# EasyEDA Pro project ProProject_Access Control Interface_2024-06-07.epro

# Schematic V2.0.1 Schematic
Create Date: 2024-06-04; Page Name: Main Page.V2.0.1 Schematic; Project Name: Access Control Interface; Schematic Name: V2.0.1 Schematic; Update Date: 2024-06-07; Company: RIT SHED MAKERSPACE; Drawn: Jim Heaney; Page Size: A4; Part Number: JLCPCB-002; Reviewed: Jim Heaney; Version: V0.1
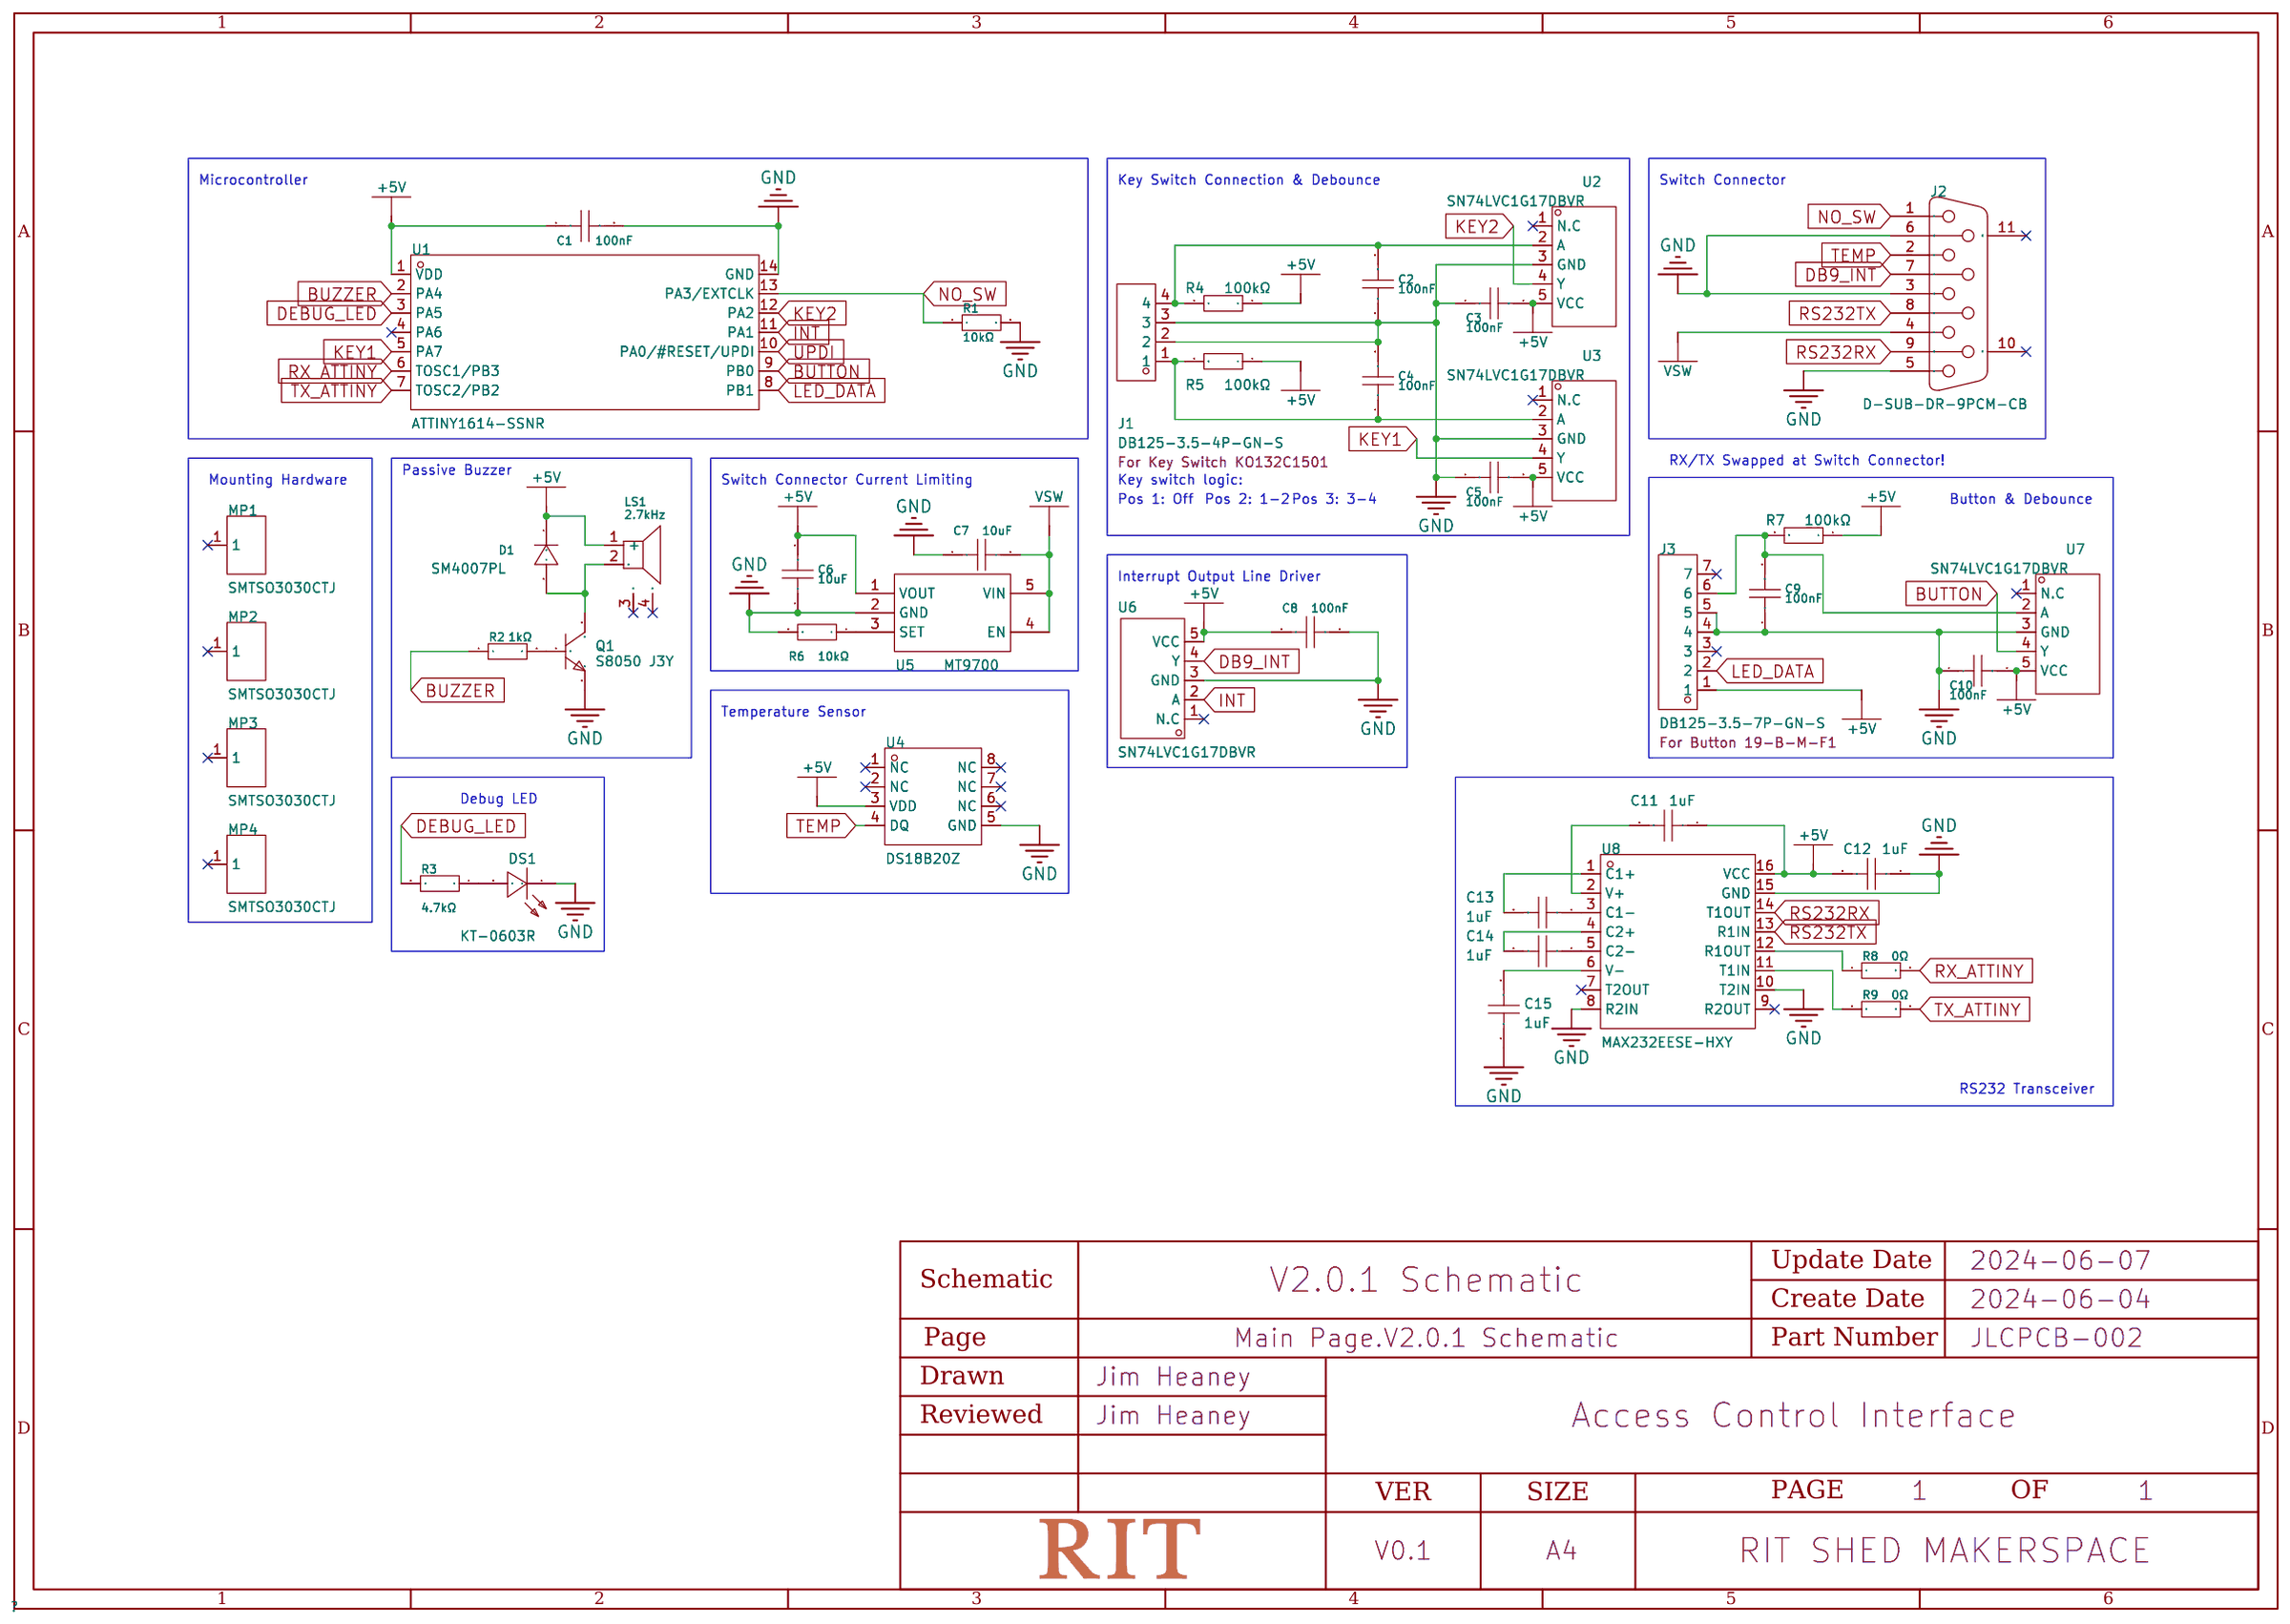
[diagram p0: schematic sheet]

## Parts
C1  100nF  [C0603]
C2  100nF  [C0603]
C3  100nF  [C0603]
C4  100nF  [C0603]
C5  100nF  [C0603]
C6  10uF  [C0603]
C7  10uF  [C0603]
C8  100nF  [C0603]
C9  100nF  [C0603]
C10  100nF  [C0603]
C11  1uF  [C0603]
C12  1uF  [C0603]
C13  1uF  [C0603]
C14  1uF  [C0603]
C15  1uF  [C0603]
D1  SM4007PL  [SOD-123F_L2.8-W1.8-LS3.7-RD]
DS1  KT-0603R  [LED0603-RD]
J1  DB125-3.5-4P-GN-S  [CONN-TH_DB125-3.5-4P-GN]
J2  D-SUB-DR-9PCM-CB  [DB9-TH_ID09S33E4GV00LF]
J3  DB125-3.5-7P-GN-S  [CONN-TH_7P-P3.50_DORABO_DB125-3.5-7P-GN-S]
LS1  2.7kHz  [BUZ-SMD_4P-L8.5-W8.5-P8.50-TL]
MP1  SMTSO3030CTJ  [SMD_BD5.6-D4.1]
MP2  SMTSO3030CTJ  [SMD_BD5.6-D4.1]
MP3  SMTSO3030CTJ  [SMD_BD5.6-D4.1]
MP4  SMTSO3030CTJ  [SMD_BD5.6-D4.1]
Q1  S8050 J3Y  [SOT-23-3_L3.0-W1.7-P0.95-LS2.9-BR]
R1  10kΩ  [R0603]
R2  1kΩ  [R0603]
R3  4.7kΩ  [R0603]
R4  100kΩ  [R0603]
R5  100kΩ  [R0603]
R6  10kΩ  [R0603]
R7  100kΩ  [R0603]
R8  0Ω  [R1206]
R9  0Ω  [R1206]
U1  ATTINY1614-SSNR  [SOIC-14_L8.7-W3.9-P1.27-LS6.0-BL]
U2  SN74LVC1G17DBVR  [SOT-23-5_L3.0-W1.7-P0.95-LS2.8-BR]
U3  SN74LVC1G17DBVR  [SOT-23-5_L3.0-W1.7-P0.95-LS2.8-BR]
U4  DS18B20Z  [SOP-8_L4.9-W3.9-P1.27-LS6.0-BL]
U5  MT9700  [SOT-23-5_L3.0-W1.7-P0.95-LS2.8-BR]
U6  SN74LVC1G17DBVR  [SOT-23-5_L3.0-W1.7-P0.95-LS2.8-BR]
U7  SN74LVC1G17DBVR  [SOT-23-5_L3.0-W1.7-P0.95-LS2.8-BR]
U8  MAX232EESE-HXY  [SOP-16_L9.9-W3.9-P1.27-LS6.0-BL]

## Library data of the parts
C1-C5 C8-C10 = CC0603KRX7R9BB104: Capacitance: Tolerance:±10% Tolerance:±10% Voltage Rated: Temperature Coefficient:; LCSC Part Name: 100nF ±10% 50V; Supplier Part: C14663; Manufacturer: YAGEO(国巨); Supplier Footprint: 0603; JLCPCB Part Class: Basic Part; Datasheet: https://atta.szlcsc.com/upload/public/pdf/source/20180910/C282072_33301C7F631E79921B82A8DAC6BCC5B3.pdf; Supplier: LCSC; Tolerance: ±10%
C6 C7 = CL10A106MA8NRNC: Capacitance: Tolerance:±20% Tolerance:±20% Voltage Rated: Temperature Coefficient:; LCSC Part Name: 10uF ±20% 25V; Supplier Part: C96446; Manufacturer: SAMSUNG(三星); Supplier Footprint: 0603; JLCPCB Part Class: Basic Part; Datasheet: https://atta.szlcsc.com/upload/public/pdf/source/20160218/1457707763339.pdf; Supplier: LCSC; Tolerance: ±20%
C11-C15 = CL10A105KB8NNNC: Capacitance: Tolerance:±10% Tolerance:±10% Voltage Rated: Temperature Coefficient:; LCSC Part Name: 1uF ±10% 50V; Supplier Part: C15849; Manufacturer: SAMSUNG(三星); Supplier Footprint: 0603; JLCPCB Part Class: Basic Part; Datasheet: https://atta.szlcsc.com/upload/public/pdf/source/20160218/1457707763339.pdf; Supplier: LCSC; Tolerance: ±10%
D1 = SM4007PL_C64898: Diode Configuration: Forward Voltage (Vf@If):1.1V@1A Reverse Voltage (Vr): Average Rectified Current (Io): Reverse Leakage Current:10uA@1kV; LCSC Part Name: 电压:1kV 电流:1A; Supplier Part: C64898; Manufacturer: MDD; Supplier Footprint: SOD-123FL; JLCPCB Part Class: Basic Part; Datasheet: https://atta.szlcsc.com/upload/public/pdf/source/20230823/16A8FDE162764C9B685A3717F2DA3690.pdf; Supplier: LCSC; Forward Voltage (Vf@If): 1.1V@1A; Reverse Leakage Current: 10uA@1kV
DS1 = KT-0603R: Emitted Color:Red Power Dissipation:- Forward Current:- Dominant Wavelength:- Dominant Wavelength:- Peak Wavelength:- Diode Configuration:- Lens Color:- Color Temperature:- Color Temperature:- Viewing Angle:- Mounting Sytle:- Operating Temperature:-40℃~+8; LCSC Part Name: 0603 红灯 高亮; Supplier Part: C2286; Manufacturer: KENTO; Supplier Footprint: 0603; JLCPCB Part Class: Basic Part; Datasheet: https://atta.szlcsc.com/upload/public/pdf/source/20160616/1466072038404.pdf; Supplier: LCSC; Emitted Color: Red; Operating Temperature: -40℃~+85℃
J1 = DB125-3.5-4P-GN-S: For Key Switch KO132C1501; LCSC Part Name: 3.5mm 1x4P 排数:1 每排P数:4 直插; Supplier Part: C2757925; Manufacturer: DORABO(地博电气); Supplier Footprint: 插件,P=3.5mm; JLCPCB Part Class: Extended Part; Datasheet: https://atta.szlcsc.com/upload/public/pdf/source/20221227/3B943AA1CFCAE24F1BA4E72404938A89.pdf; Supplier: LCSC; Structure: 1x4P; Pitch: 3.5mm; Color: Green; Mounting Style: Straight; Current Rating (Max): 13.5A; Voltage Rating (Max): 250V; Number of Pins: 4P; Number of Rows: 1; Wire Gauge - AWG: 16~28; Wire Gauge - mm2: 1; Number of PINs Per Row: 4; Operating Temperature Range: -40℃~+105℃
J2 = D-SUB-DR-9PCM-CB: Connector Type:D-Sub Gender:Female Number of Pins:9P Mounting Style:Right-Angle Number of Rows:2 Current Rating (Max):3A Contact Plating:Tin Operating Temperature Range:-50℃~+105℃ Operating Temperature Range:-50℃~+105℃; LCSC Part Name: D-Sub 母 P数:9P; Supplier Part: C19077337; Manufacturer: XUNPU(讯普); Supplier Footprint: 弯插; JLCPCB Part Class: Extended Part; Datasheet: https://atta.szlcsc.com/upload/public/pdf/source/20231108/FB2E8AB0BE4F620DDF3F7F4D0B9AFB97.pdf; Supplier: LCSC; Connector Type: D-Sub; Gender: Female; Number of Pins: 9P; Mounting Style: Right-Angle; Number of Rows: 2; Current Rating (Max): 3A; Contact Plating: Tin; Operating Temperature Range: -50℃~+105℃
J3 = DB125-3.5-7P-GN-S: For Button 19-B-M-F1; Supplier Part: C5155542; Manufacturer: DORABO(地博电气); Supplier Footprint: 插件,P=3.5mm; JLCPCB Part Class: Extended Part; Datasheet: https://atta.szlcsc.com/upload/public/pdf/source/20230106/6D98E0937FFC38400AEACFB8C598EDDA.pdf; Supplier: LCSC
LS1 = MLT-8540: Oscillator Circuit:无源(外部驱动) Technology Type:电磁式 Operating Voltage:2.5V~4.5V Operating Voltage:2.5V~4.5V Frequency:2.7kHz Current Consumption:- Sound Pressure Level (SPL):80dB@5V,10cm Diameter (φD):- Length:8.7mm Width:8.7mm Height:4mm Operating Temperatur; Supplier Part: C95300; Manufacturer: 华能; Supplier Footprint: SMD,8.7x8.7mm; JLCPCB Part Class: Extended Part; Datasheet: https://atta.szlcsc.com/upload/public/pdf/source/20170522/1495448323732.pdf; Supplier: LCSC; Oscillator Circuit: 无源(外部驱动); Technology Type: 电磁式; Operating Voltage: 2.5V~4.5V; Sound Pressure Level (SPL): 80dB@5V,10cm; Length: 8.7mm; Width: 8.7mm; Height: 4mm
MP1-MP4 = SMTSO3030CTJ: specifications:M3X3 surface treatment:镀锡 Product Description:- material quality:-; LCSC Part Name: 雄和远景，电路板表贴圆螺母柱，M3X3，铜镀锡,1个; Supplier Part: C2915308; Manufacturer: Sinhoo(雄和远景); JLCPCB Part Class: Extended Part; Datasheet: https://atta.szlcsc.com/upload/public/pdf/source/20211122/17CF5E24EB4D4DC090A80DE3D7DE5E21.pdf; Supplier: LCSC; specifications: M3X3; surface treatment: 镀锡
Q1 = S8050 J3Y_C2146: Transistor Type: Collector Current (Ic): Collector-Emitter Breakdown Voltage (Vceo): Power Dissipation (Pd): DC Current Gain (hFE@Ic,Vce):200@50mA,1V DC Current Gain (hFE@Ic,Vce):200@50mA,1V Transition Frequency (fT):150MHz Collector Cut-Off Current (Icbo; LCSC Part Name: S8050 J3Y(RANGE:200-350) H档(200-350); Supplier Part: C2146; Manufacturer: CJ(江苏长电/长晶); Supplier Footprint: SOT-23; JLCPCB Part Class: Basic Part; Datasheet: https://atta.szlcsc.com/upload/public/pdf/source/20140809/1457707209234.pdf; Supplier: LCSC; DC Current Gain (hFE@Ic,Vce): 200@50mA,1V; Transition Frequency (fT): 150MHz; Collector Cut-Off Current (Icbo): 100nA; Collector-Emitter Saturation Voltage (VCE(sat)@Ic,Ib): 600mV@500mA,50mA
R1 R6 = 0603WAF1002T5E: Type:Thick Film Resistors Resistance:10kΩ Tolerance:±1% Tolerance:±1% Power(Watts): Overload Voltage (Max): Temperature Coefficient:±100ppm/℃ Temperature Coefficient:±100ppm/℃ Operating Temperature Range:-55℃~+155℃ Operating Temperature Range:-55℃~+155℃; LCSC Part Name: 厚膜电阻 10kΩ ±1% 100mW; Supplier Part: C25804; Manufacturer: UNI-ROYAL(厚声); Supplier Footprint: 0603; JLCPCB Part Class: Basic Part; Datasheet: https://atta.szlcsc.com/upload/public/pdf/source/20200306/C422600_1E6D84923E4A46A82E41ADD87F860B5C.pdf; Supplier: LCSC; Type: Thick Film Resistors; Tolerance: ±1%; Temperature Coefficient: ±100ppm/℃; Operating Temperature Range: -55℃~+155℃
R2 = 0603WAF1001T5E: Type:Thick Film Resistors Resistance:1kΩ Tolerance:±1% Tolerance:±1% Power(Watts): Overload Voltage (Max): Temperature Coefficient:±100ppm/℃ Temperature Coefficient:±100ppm/℃ Operating Temperature Range:-55℃~+155℃ Operating Temperature Range:-55℃~+155℃; LCSC Part Name: 1kΩ ±1% 100mW 厚膜电阻; Supplier Part: C21190; Manufacturer: UNI-ROYAL(厚声); Supplier Footprint: 0603; JLCPCB Part Class: Basic Part; Datasheet: https://atta.szlcsc.com/upload/public/pdf/source/20200306/C422600_1E6D84923E4A46A82E41ADD87F860B5C.pdf; Supplier: LCSC; Type: Thick Film Resistors; Tolerance: ±1%; Temperature Coefficient: ±100ppm/℃; Operating Temperature Range: -55℃~+155℃
R3 = 0603WAF4701T5E: Type:Thick Film Resistors Resistance:4.7kΩ Tolerance:±1% Tolerance:±1% Power(Watts): Overload Voltage (Max): Temperature Coefficient:±100ppm/℃ Temperature Coefficient:±100ppm/℃ Operating Temperature Range:-55℃~+155℃ Operating Temperature Range:-55℃~+155℃; LCSC Part Name: 4.7kΩ ±1% 100mW 厚膜电阻; Supplier Part: C23162; Manufacturer: UNI-ROYAL(厚声); Supplier Footprint: 0603; JLCPCB Part Class: Basic Part; Datasheet: https://atta.szlcsc.com/upload/public/pdf/source/20200306/C422600_1E6D84923E4A46A82E41ADD87F860B5C.pdf; Supplier: LCSC; Type: Thick Film Resistors; Tolerance: ±1%; Temperature Coefficient: ±100ppm/℃; Operating Temperature Range: -55℃~+155℃
R4 R5 R7 = 0603WAF1003T5E: Type:Thick Film Resistors Resistance:100kΩ Tolerance:±1% Tolerance:±1% Power(Watts): Overload Voltage (Max): Temperature Coefficient:±100ppm/℃ Temperature Coefficient:±100ppm/℃ Operating Temperature Range:-55℃~+155℃ Operating Temperature Range:-55℃~+155℃; LCSC Part Name: 100kΩ ±1% 100mW 厚膜电阻; Supplier Part: C25803; Manufacturer: UNI-ROYAL(厚声); Supplier Footprint: 0603; JLCPCB Part Class: Basic Part; Datasheet: https://atta.szlcsc.com/upload/public/pdf/source/20200306/C422600_1E6D84923E4A46A82E41ADD87F860B5C.pdf; Supplier: LCSC; Type: Thick Film Resistors; Tolerance: ±1%; Temperature Coefficient: ±100ppm/℃; Operating Temperature Range: -55℃~+155℃
R8 R9 = 1206W4F0000T5E: Type:Thick Film Resistors Resistance: Tolerance:±1% Tolerance:±1% Power(Watts): Overload Voltage (Max): Temperature Coefficient:±800ppm/℃ Temperature Coefficient:±800ppm/℃ Operating Temperature Range:-55℃~+155℃ Operating Temperature Range:-55℃~+155℃; LCSC Part Name: 0Ω ±1% 250mW 厚膜电阻; Supplier Part: C17888; Manufacturer: UNI-ROYAL(厚声); Supplier Footprint: 1206; JLCPCB Part Class: Basic Part; Datasheet: https://atta.szlcsc.com/upload/public/pdf/source/20200306/C422600_1E6D84923E4A46A82E41ADD87F860B5C.pdf; Supplier: LCSC; Type: Thick Film Resistors; Tolerance: ±1%; Temperature Coefficient: ±800ppm/℃; Operating Temperature Range: -55℃~+155℃
U1 = ATTINY1614-SSNR: CPU Core:AVR Program Storage Size:16KB RAM Size:2KB GPIO Ports Number:12 Operating Voltage Range:1.8V~5.5V Operating Voltage Range:1.8V~5.5V CPU Maximum Speed:20MHz Program Memory Type:FLASH Operating Temperature Range:-40℃~+105℃ Operating Temperature Ran; Supplier Part: C481364; Manufacturer: MICROCHIP(美国微芯); Supplier Footprint: SOIC-14; JLCPCB Part Class: Extended Part; Datasheet: https://atta.szlcsc.com/upload/public/pdf/source/20210602/FC8A9F430ECD1E098D2B5E95CDE2B28C.pdf; Supplier: LCSC; CPU Core: AVR; Program Storage Size: 16KB; RAM Size: 2KB; GPIO Ports Number: 12; Operating Voltage Range: 1.8V~5.5V; CPU Maximum Speed: 20MHz; Program Memory Type: FLASH; Operating Temperature Range: -40℃~+105℃; ADC (Bit): 10bit; DAC (Bit): 8bit; Peripheral/Function: WDT；PWM; Watchdog: 有; Infrared Data Association: 有; Low-Voltage Detect: 有; Internal Oscillator: 有
U2 U3 U6 U7 = SN74LVC1G17DBVR: Input type:Schmitt Trigger output type:推挽 Supply Voltage:1.65V~5.5V Supply Voltage:1.65V~5.5V Number of Elements:1 Number of Bits per Element:1 Sink Current:32mA Source Current:32mA Logic Family:74LVC Operating Temperature:-40℃~+125℃ Operating Temperature; Supplier Part: C7836; Manufacturer: TI(德州仪器); Supplier Footprint: SOT-23-5; JLCPCB Part Class: Extended Part; Datasheet: https://www.ti.com/cn/lit/gpn/sn74lvc1g17; Supplier: LCSC; Input type: Schmitt Trigger; output type: 推挽; Supply Voltage: 1.65V~5.5V; Number of Elements: 1; Number of Bits per Element: 1; Sink Current: 32mA; Source Current: 32mA; Logic Family: 74LVC; Operating Temperature: -40℃~+125℃
U4 = DS18B20Z: Resolution:±0.4℃ Resolution:±0.4℃ Supply Voltage:2.5V~5.5V Supply Voltage:2.5V~5.5V; LCSC Part Name: 温度传感器; Supplier Part: C695837; Manufacturer: UMW(友台半导体); Supplier Footprint: SOIC-8; JLCPCB Part Class: Extended Part; Datasheet: https://atta.szlcsc.com/upload/public/pdf/source/20231109/DC3DA9D47D486EF40A6E0F08B9A498E3.pdf; Supplier: LCSC; Resolution: ±0.4℃; Supply Voltage: 2.5V~5.5V
U5 = MT9700: Supplier Part: C89855; Manufacturer: 西安航天民芯; Supplier Footprint: SOT-23-5; JLCPCB Part Class: Extended Part; Datasheet: https://atta.szlcsc.com/upload/public/pdf/source/20170418/1492481333031.pdf; Supplier: LCSC
U8 = MAX232EESE-HXY: Driver/receiver:2/2 Data Rate:120Kbps Data Rate:120Kbps Supply Voltage:5V Supply Voltage:5V; Supplier Part: C19626971; Manufacturer: HXY MOSFET(华轩阳电子); Supplier Footprint: SOP-16; JLCPCB Part Class: Extended Part; Datasheet: https://atta.szlcsc.com/upload/public/pdf/source/20231215/08C47B9710D348E23143C3CE5F7DFFF8.pdf; Supplier: LCSC; Driver/receiver: 2/2; Data Rate: 120Kbps; Supply Voltage: 5V

## Nets
+5V: C1.1 C3.2 C5.2 C6.2 C8.1 C10.2 C11.1 C12.2 D1.1(C) J3.1 LS1.1(+) R4.1 R5.1 R7.1 U1.1(VDD) U2.5(VCC) U3.5(VCC) U4.3(VDD) U5.1(VOUT) U6.5(VCC) U7.5(VCC) U8.16(VCC)
GND: C1.2 C2.1 C3.1 C4.2 C5.1 C6.1 C7.2 C8.2 C9.1 C10.1 C12.1 C15.1 DS1.1(K) J1.2 J1.3 J2.3 J2.5 J2.6 J3.4 J3.5 Q1.2(E) R1.2 R6.2 U1.14(GND) U2.3(GND) U3.3(GND) U4.5(GND) U5.2(GND) U6.3(GND) U7.3(GND) U8.8(R2IN) U8.10(T2IN) U8.15(GND)
BUTTON: U1.9(PB0) U7.4(Y)
BUZZER: R2.1 U1.2(PA4)
DB9_INT: J2.7 U6.4(Y)
DEBUG_LED: R3.2 U1.3(PA5)
INT: U1.11(PA1) U6.2(A)
KEY1: U1.5(PA7) U3.4(Y)
KEY2: U1.12(PA2) U2.4(Y)
LED_DATA: J3.2 U1.8(PB1)
NO_SW: J2.1 R1.1 U1.13(PA3/EXTCLK)
RS232RX: J2.9 U8.14(T1OUT)
RS232TX: J2.8 U8.13(R1IN)
RX_ATTINY: R8.2 U1.6(TOSC1/PB3)
TEMP: J2.2 U4.4(DQ)
TX_ATTINY: R9.2 U1.7(TOSC2/PB2)
UPDI: U1.10(PA0/#RESET/UPDI)
VSW: C7.1 J2.4 U5.4(EN) U5.5(VIN)
$1N778: R6.1 U5.3(SET)
$1N1205: C15.2 U8.6(V-)
$1N1207: C14.1 U8.5(C2-)
$1N1208: C11.2 U8.2(V+)
$1N1209: C14.2 U8.4(C2+)
$1N1210: C13.1 U8.3(C1-)
$1N1211: C13.2 U8.1(C1+)
$1N1389: R8.1 U8.12(R1OUT)
$1N1393: R9.1 U8.11(T1IN)
$1N2440: Q1.1(B) R2.2
$1N2442: D1.2(A) LS1.2 Q1.3(C)
$1N2545: DS1.2(A) R3.1
$1N3356: C2.2 J1.4 R4.2 U2.2(A)
$1N3363: C4.1 J1.1 R5.2 U3.2(A)
$1N3670: C9.2 J3.6 R7.2 U7.2(A)

Not connected (* = marked no-connect by the designer): J2 10(MH1)* 11(MH2)*; J3 3* 7*; LS1 3(NC)* 4(NC)*; MP1 1*; MP2 1*; MP3 1*; MP4 1*; U1 4(PA6)*; U2 1(N.C)*; U3 1(N.C)*; U4 1(NC)* 2(NC)* 6(NC)* 7(NC)* 8(NC)*; U6 1(N.C)*; U7 1(N.C)*; U8 7(T2OUT)* 9(R2OUT)*

## Notes on the sheet
- Microcontroller
- Key Switch Connection & Debounce
- Switch Connector
- Passive Buzzer
- RX/TX Swapped at Switch Connector!
- Mounting Hardware
- Switch Connector Current Limiting
- Key switch logic:
- Pos 1: Off
- Pos 2: 1-2
- Pos 3: 3-4
- Button & Debounce
- Interrupt Output Line Driver
- Temperature Sensor
- Debug LED
- RS232 Transceiver

# Board V2.0.1 PCB
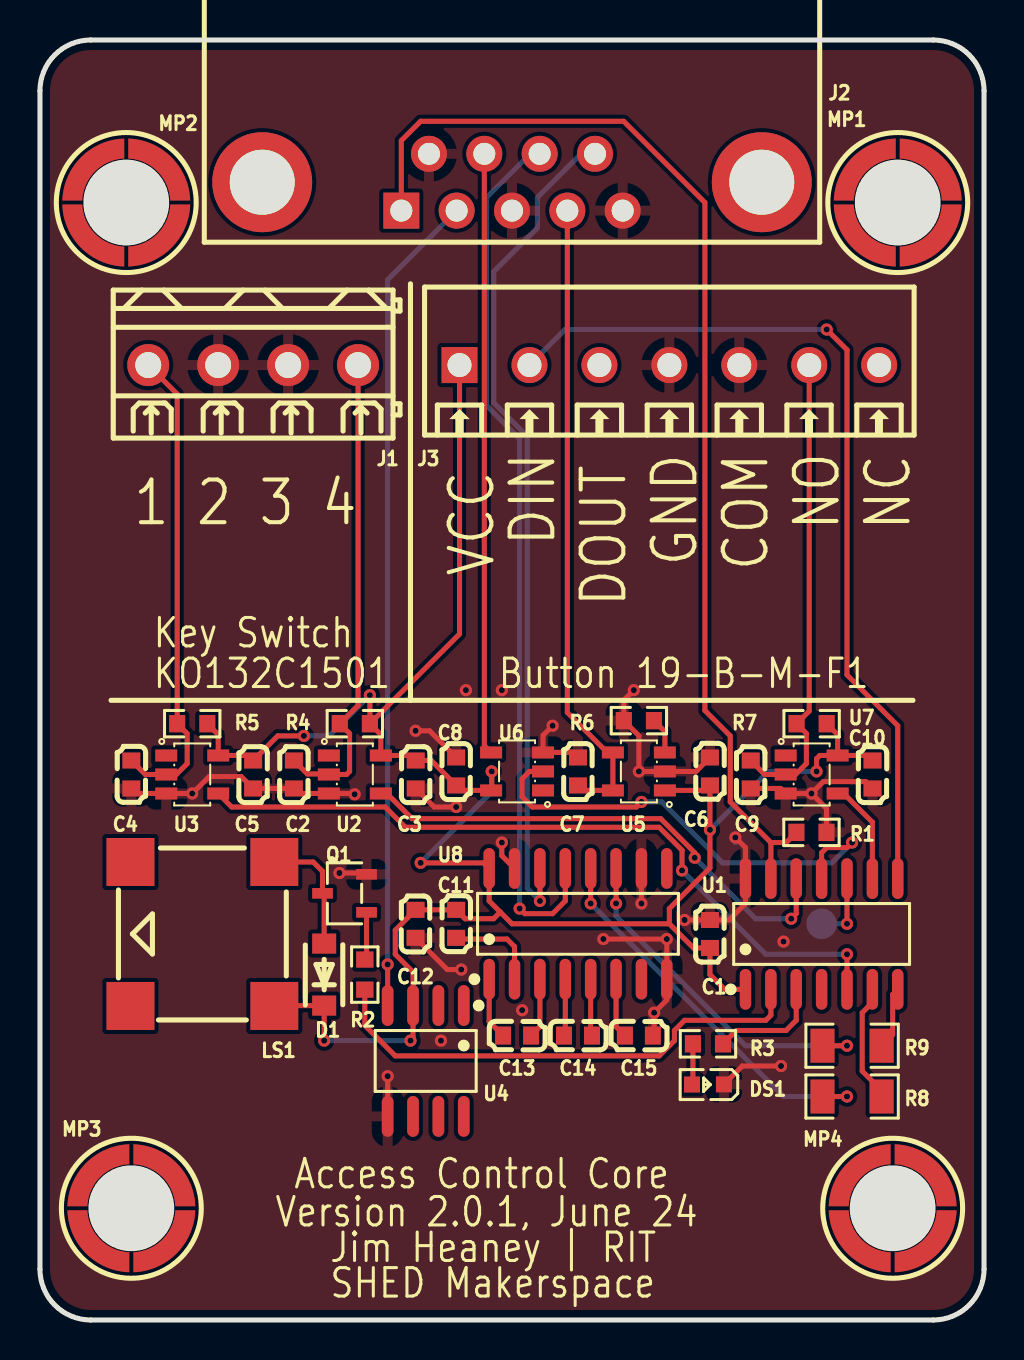
[diagram p1: board, top side]
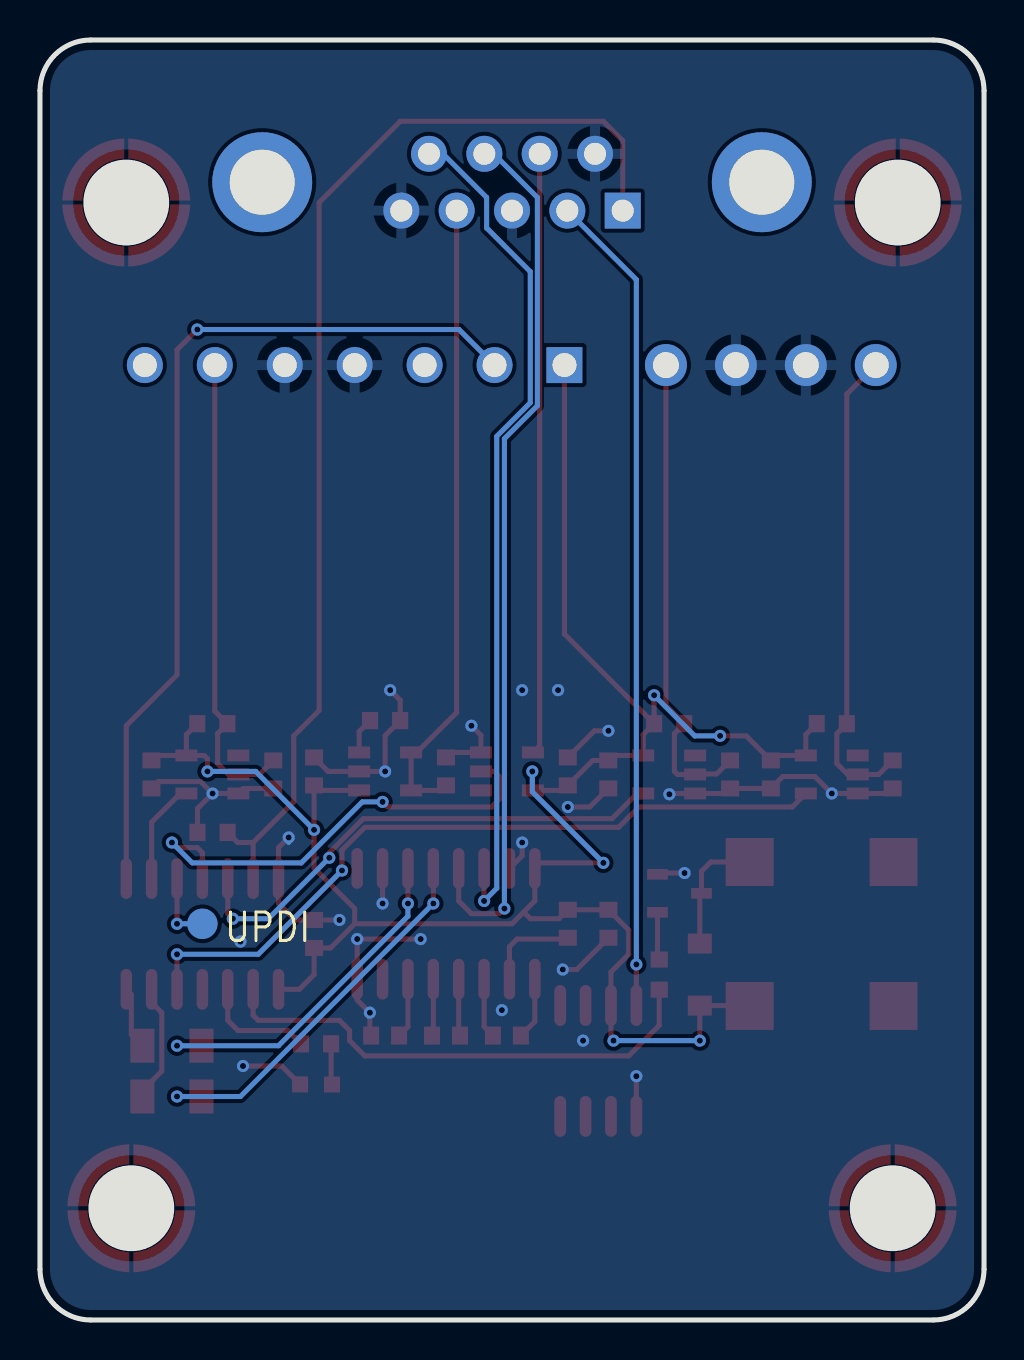
[diagram p2: board, bottom side, seen from below]

Outline 47.24 x 64.01 mm; copper layers: Top Layer, Bottom Layer. Coordinates in mm from the lower left corner of the outline.
Outline path: 0,61.47 0,2.54 arc(0.74,0.74) 2.54,0 44.7,0 arc(46.5,0.74) 47.24,2.54 47.24,61.47 arc(46.5,63.26) 44.7,64.01 2.54,64.01 arc(0.74,63.26) 0,61.47
Stack: Top Layer 0.035mm / Dielectric1 1.51mm FR4 er 4.5 / Bottom Layer 0.035mm

## Design rules (mm)
template: JLCPCB Capability(Two Layers Board)
spacing copperThickness1oz (default): track to track 0.102, other pairs 0.152 to 0.3
spacing copperThickness2oz: track to track 0.203, other pairs 0.152 to 0.3
track width copperThickness1oz (default): min 0.127, default 0.254, max 2.54
track width copperThickness2oz: min 0.203, default 0.254, max 2.54
differential pair differentialPair (default): width min 0.127, default 0.254, max 2.54; gap min 0.152, default 0.152
via viaSize (default): diameter min 0.5, default 0.61, max 10; hole min 0.3, default 0.305, max 6.3

## Placement (name value [footprint] x y rotation side)
C1  100nF  [C0603]  33.53 19.3 90 top
C2  100nF  [C0603]  12.71 27.28 90 top
C3  100nF  [C0603]  18.81 27.28 90 top
C4  100nF  [C0603]  4.57 27.28 270 top
C5  100nF  [C0603]  10.67 27.28 90 top
C6  10uF  [C0603]  33.53 27.43 270 top
C7  10uF  [C0603]  26.92 27.43 90 top
C8  100nF  [C0603]  20.83 27.43 90 top
C9  100nF  [C0603]  35.57 27.28 90 top
C10  100nF  [C0603]  41.67 27.28 90 top
C11  1uF  [C0603]  20.83 19.81 270 top
C12  1uF  [C0603]  18.8 19.81 90 top
C13  1uF  [C0603]  23.88 14.22 180 top
C14  1uF  [C0603]  26.92 14.22 180 top
C15  1uF  [C0603]  29.97 14.22 180 top
D1  SM4007PL  [SOD-123F_L2.8-W1.8-LS3.7-RD]  14.22 17.27 90 top
DS1  KT-0603R  [LED0603-RD]  33.43 11.78 180 top
J1  DB125-3.5-4P-GN-S  [CONN-TH_DB125-3.5-4P-GN]  10.67 47.75 0 top
J2  D-SUB-DR-9PCM-CB  [DB9-TH_ID09S33E4GV00LF]  23.62 56.9 180 top
J3  DB125-3.5-7P-GN-S  [CONN-TH_7P-P3.50_DORABO_DB125-3.5-7P-GN-S]  31.5 47.75 0 top
LS1  2.7kHz  [BUZ-SMD_4P-L8.5-W8.5-P8.50-TL]  8.13 19.3 180 top
MP1  SMTSO3030CTJ  [SMD_BD5.6-D4.1]  42.93 55.88 0 top
MP2  SMTSO3030CTJ  [SMD_BD5.6-D4.1]  4.32 55.88 0 top
MP3  SMTSO3030CTJ  [SMD_BD5.6-D4.1]  4.57 5.59 0 top
MP4  SMTSO3030CTJ  [SMD_BD5.6-D4.1]  42.67 5.59 0 top
NOREF  -  [Pad_e344]  39.12 19.81 0 top
Q1  S8050 J3Y  [SOT-23-3_L3.0-W1.7-P0.95-LS2.9-BR]  15.24 21.34 0 top
R1  10kΩ  [R0603]  38.61 24.38 0 top
R2  1kΩ  [R0603]  16.25 17.27 90 top
R3  4.7kΩ  [R0603]  33.43 13.81 0 top
R4  100kΩ  [R0603]  15.76 29.82 180 top
R5  100kΩ  [R0603]  7.62 29.82 180 top
R6  10kΩ  [R0603]  29.97 29.97 180 top
R7  100kΩ  [R0603]  38.62 29.82 180 top
R8  0Ω  [R1206]  40.64 11.18 0 top
R9  0Ω  [R1206]  40.64 13.72 0 top
U1  ATTINY1614-SSNR  [SOIC-14_L8.7-W3.9-P1.27-LS6.0-BL]  39.12 19.3 0 top
U2  SN74LVC1G17DBVR  [SOT-23-5_L3.0-W1.7-P0.95-LS2.8-BR]  15.76 27.28 180 top
U3  SN74LVC1G17DBVR  [SOT-23-5_L3.0-W1.7-P0.95-LS2.8-BR]  7.62 27.28 180 top
U4  DS18B20Z  [SOIC-8_L4.9-W3.9-P1.27-LS6.0-BL]  19.3 12.95 180 top
U5  MT9700  [SOT-23-5_L3.0-W1.7-P0.95-LS2.8-BR]  29.97 27.43 0 top
U6  SN74LVC1G17DBVR  [SOT-23-5_L3.0-W1.7-P0.95-LS2.8-BR]  23.88 27.43 0 top
U7  SN74LVC1G17DBVR  [SOT-23-5_L3.0-W1.7-P0.95-LS2.8-BR]  38.62 27.28 180 top
U8  MAX232EESE-HXY  [SOP-16_L9.9-W3.9-P1.27-LS6.0-BL]  26.92 19.81 0 top

## Footprints (pads in the part's own frame, mm; a bottom-side part is the same pattern mirrored in y, then rotated)
BUZ-SMD_4P-L8.5-W8.5-P8.50-TL
  rect 2.4x2.4 smd: 1(-3.6,3.6) 2(-3.6,-3.6) 3(3.599,-3.599) 4(3.6,3.6)
C0603
  rect 0.8x0.9 smd: 1(-0.7,0) 2(0.7,0)
CONN-TH_7P-P3.50_DORABO_DB125-3.5-7P-GN-S
  rect 1.8x1.8 hole 1.2: 1(-10.5,0)
  round 1.8 hole 1.2: 2(-7,0) 3(-3.5,0) 4(0,0) 5(3.5,0) 6(7,0) 7(10.5,0)
CONN-TH_DB125-3.5-4P-GN
  round 2.1 hole 1.3: 1(-5.25,0) 2(-1.75,0) 3(1.75,0) 4(5.25,0)
DB9-TH_ID09S33E4GV00LF
  rect 1.8x1.8 hole 1.1: 1(5.54,1.42)
  round 1.8 hole 1.1: 2(2.77,1.42) 3(0,1.42) 4(-2.77,1.42) 5(-5.54,1.42) 6(4.155,-1.42) 7(1.385,-1.42) 8(-1.385,-1.42) 9(-4.155,-1.42)
  round 5 hole 3.25: 10(-12.5,0) 11(12.5,0)
LED0603-RD
  rect 0.8x0.8 smd: 1(-0.799,-0.004) 2(0.799,0.004)
Pad_e344
  round 1.524 smd far side: 17(0,0)
R0603
  rect 0.806x0.864 smd: 1(-0.753,0) 2(0.753,0)
R1206
  rect 1.208x1.701 smd: 1(-1.479,0) 2(1.479,0)
SMD_BD5.6-D4.1
  custom 3.1x3.1 smd: 1(-2.102,1.65) 2(1.65,2.102) 3(2.102,-1.65) 4(-1.65,-2.102)
SOD-123F_L2.8-W1.8-LS3.7-RD
  rect 1x1.2 smd: 1(-1.55,0) 2(1.55,0)
SOIC-8_L4.9-W3.9-P1.27-LS6.0-BL
  oval 0.588x2.045 smd: 1(-1.905,-2.772) 2(-0.635,-2.772) 3(0.635,-2.772) 4(1.905,-2.772) 5(1.905,2.772) 6(0.635,2.772) 7(-0.635,2.772) 8(-1.905,2.772)
SOIC-14_L8.7-W3.9-P1.27-LS6.0-BL
  oval 0.574x2.038 smd: 1(-3.81,-2.769) 2(-2.54,-2.769) 3(-1.27,-2.769) 4(0,-2.769) 5(1.27,-2.769) 6(2.54,-2.769) 7(3.81,-2.769) 8(3.81,2.769) 9(2.54,2.769) 10(1.27,2.769) 11(0,2.769) 12(-1.27,2.769) 13(-2.54,2.769) 14(-3.81,2.769)
SOP-16_L9.9-W3.9-P1.27-LS6.0-BL
  oval 0.574x2.038 smd: 1(-4.445,-2.769) 2(-3.175,-2.769) 3(-1.905,-2.769) 4(-0.635,-2.769) 5(0.635,-2.769) 6(1.905,-2.769) 7(3.175,-2.769) 8(4.445,-2.769) 9(4.445,2.769) 10(3.175,2.769) 11(1.905,2.769) 12(0.635,2.769) 13(-0.635,2.769) 14(-1.905,2.769) 15(-3.175,2.769) 16(-4.445,2.769)
SOT-23-3_L3.0-W1.7-P0.95-LS2.9-BR
  rect 1.038x0.532 smd: 1(1.101,-0.95) 2(1.101,0.95) 3(-1.101,0)
SOT-23-5_L3.0-W1.7-P0.95-LS2.8-BR
  rect 1.1x0.6 smd: 1(1.3,-0.95) 2(1.3,0) 3(1.3,0.95) 4(-1.3,0.95) 5(-1.3,-0.95)

## Nets
As in the schematic, except:
UPDI: NOREF.17 U1.10

Pads without a net: J2 10 11; J3 3 7; LS1 3 4; MP1 1 2 3 4; MP2 1 2 3 4; MP3 1 2 3 4; MP4 1 2 3 4; U1 4; U2 1; U3 1; U4 1 2 6 7 8; U6 1; U7 1; U8 7 9

## Via types
v1: diameter 0.61, hole 0.305, Top Layer to Bottom Layer, 47 vias

## Routing (per net, layer and track width the routed paths; a pad name or vN(x,y) marks a point on that pad's centre or on a via; arc(x,y) is an arc through that point)
+5V: length 110.5
  Top Layer w0.254: v1(13.21,29.21) 11.9,29.21 C5.2 10.42,28.23 U3.5 8.92,29.27 R5.1 ; 22.58,22.68 U8.16 ; U8.16 22.48,20.95 23.03,20.4 ; U8.16 22.2,22.86 v1(19.05,22.86) ; R4.1 21,34.3 J3.1 ; R4.1 17.06,29.27 U2.5 18.56,28.23 C3.2 19.58,27.98 C8.1 21.08,26.48 U6.5 22.61,26.51 v1(22.61,27.43) ; R4.1 v1(16.51,31.24) ; LS1.1 11.75,15.72 D1.1 v1(14.22,13.97) ; C10.2 41.42,28.23 39.92,28.23 ; 31.5,19.81 31.5,20.57 33.53,22.61 v1(33.53,24.51) C6.2 33.28,26.48 U5.1 ; 31.5,19.81 23.62,19.81 23.03,20.4 ; 31.5,19.81 32.7,18.6 C1.1 33.53,17.27 34.27,16.53 U1.1 ; v1(18.54,13.97) 18.67,14.1 U4.3 18.67,17.4 17.78,18.29 17.78,19.5 C12.2 C11.1 21.27,20.07 22.7,20.07 23.03,20.4 ; 39.92,28.23 39.02,28.23 38.86,28.07 v1(38.86,27.43) ; 39.92,28.23 39.92,29.27 R7.1
  Bottom Layer w0.254: v1(16.51,31.24) 14.48,29.21 v1(13.21,29.21) ; v1(19.05,22.86) 22.61,26.42 v1(22.61,27.43) ; v1(14.22,13.97) v1(18.54,13.97) ; v1(38.86,27.43) 36.45,27.43 v1(33.53,24.51)
GND: length 66
  Top Layer w0.254: 35.57,26.58 37.07,26.58 U7.3 v1(38.61,26.33) ; v1(32.26,20) C1.2 34.48,20 35.31,20.83 U1.14 35.31,23.62 v1(34.8,24.13) ; v1(21.08,17.53) 20.38,17.53 C12.1 ; Q1.2 16.28,22.35 v1(14.99,22.35) ; v1(29.72,31.5) 29.22,31 R6.2 29.97,29.22 v1(29.97,27.43) U5.2 32.83,27.43 C6.1 ; U8.15 23.11,23.22 v1(23.11,23.88) ; v1(20.83,25.65) 19.73,25.65 18.81,26.58 ; C15.1 30.73,14.29 v1(30.73,15.37) 31.37,16 v1(31.37,19.05) v1(28.19,19.05) ; v1(18.8,29.46) 19.5,29.46 C8.2 ; 41.67,26.58 41.32,26.92 39.2,26.92 v1(38.61,26.33) ; R1.2 39.36,25.58 v1(38.61,26.33) ; 4.57,26.58 4.82,26.33 U3.3 v1(7.62,26.33) 8.47,27.18 10.07,27.18 10.67,26.58 12.71,26.58 12.96,26.33 U2.3 15.71,26.33 v1(15.75,26.29) ; v1(25.65,29.72) 25.18,29.24 U6.3 26.67,28.38 C7.2 ; U8.10 v1(30.1,20.83) ; v1(37.08,12.7) 35.15,12.7 DS1.1 ; U4.5 v1(17.4,12.19)
  Bottom Layer w0.254: v1(34.8,24.13) 34.8,23.88
  vias: v1(20.07,13.97) v1(21.32,31.5) v1(23.11,31.5) v1(24.13,15.49) v1(37.21,18.92)
BUTTON: length 5.2
  Top Layer w0.254: 39.92,26.33 40.22,26.33 41.66,24.89 U1.9
BUZZER: length 25.2
  Top Layer w0.254: U1.2 36.58,15.24 36.32,14.99 32.26,14.99 31.75,14.48 31.75,13.97 30.99,13.21 17.78,13.21 16.25,14.73 R2.1
DB9_INT: length 30.1
  Top Layer w0.254: 22.24,58.32 22.24,28.72 U6.4
DEBUG_LED: length 5.7
  Top Layer w0.254: U1.3 37.85,14.99 37.34,14.48 34.85,14.48 R3.2
INT: length 23.6
  Top Layer w0.254: U1.11 39.12,23.37 39.37,23.62 40.39,23.62 v1(40.64,23.88) ; U6.2 24.5,27.43 24.13,27.06 24.13,26.16 24.64,25.65 29.84,25.65 v1(30.1,25.91)
  Bottom Layer w0.254: v1(30.1,25.91) 31.12,25.91 34.16,22.86 39.62,22.86 v1(40.64,23.88)
KEY1: length 37.3
  Top Layer w0.254: U3.4 9.6,25.65 17.27,25.65 18.29,24.64 30.99,24.64 32.13,23.49 v1(32.13,22.48) ; v1(40.39,18.29) U1.5
  Bottom Layer w0.254: 32,22.35 v1(32.13,22.48) 36.32,18.29 v1(40.39,18.29)
KEY2: length 25.4
  Top Layer w0.254: U1.12 37.85,20.32 v1(37.59,20.07) ; v1(32.77,23.11) 32.77,23.37 31.06,25.07 18.62,25.07 17.36,26.33 U2.4
  Bottom Layer w0.254: v1(32.77,23.11) 35.81,20.07 v1(37.59,20.07)
LED_DATA: length 44.5
  Top Layer w0.254: U1.8 42.93,29.72 40.39,32.26 40.39,48.51 v1(39.37,49.53)
  Bottom Layer w0.254: v1(39.37,49.53) 26.27,49.53 J3.2
NO_SW: length 57.4
  Top Layer w0.254: 36.58,23.88 37.35,23.88 R1.1 ; 36.58,23.88 34.54,25.91 34.54,29.21 33.27,30.48 33.27,55.88 29.21,59.94 19.05,59.94 18.08,58.98 J2.1 ; 36.58,23.88 U1.13
RS232RX: length 42.5
  Top Layer w0.254: v1(25.02,20.95) U8.14
  Bottom Layer w0.254: J2.9 27.07,58.32 24.89,56.13 24.89,54.61 22.71,52.43 22.71,45.87 24.38,44.19 24.38,21.59 v1(25.02,20.95)
RS232TX: length 44.1
  Top Layer w0.254: v1(24,20.57) 24.26,20.32 25.65,20.32 26.29,20.95 U8.13
  Bottom Layer w0.254: v1(24,20.57) 24,44.07 22.35,45.72 22.35,56.13 24.53,58.32 J2.8
RX_ATTINY: length 6
  Top Layer w0.254: U1.6 41.66,15.87 41.15,15.37 41.15,12.45 42.12,11.47 R8.2
TEMP: length 41.2
  Top Layer w0.254: U4.4 v1(17.4,17.78)
  Bottom Layer w0.254: J2.2 17.4,52.02 v1(17.4,17.78)
TX_ATTINY: length 3.2
  Top Layer w0.254: U1.7 42.67,16.28 42.67,14.27 R9.2
UPDI: length 3.5
  Top Layer w0.254: v1(40.39,19.81) U1.10
  Bottom Layer w0.254: v1(40.39,19.81) NOREF.17
VSW: length 32
  Top Layer w0.254: J2.4 26.39,30.38 28.39,28.38 U5.4 U5.5 27.17,26.48 C7.1
$1N778: length 1.8
  Top Layer w0.254: R6.1 31.27,29.43 U5.3
$1N1205: length 3
  Top Layer w0.254: 28.83,17.04 28.83,14.67 C15.2
$1N1207: length 2.8
  Top Layer w0.254: 27.56,17.04 27.56,14.29 C14.1
$1N1208: length 4.7
  Top Layer w0.254: 23.75,17.04 23.75,18.67 23.37,19.05 20.89,19.05 C11.2
$1N1209: length 2.8
  Top Layer w0.254: C14.2 26.29,14.29 26.29,17.04
$1N1210: length 3
  Top Layer w0.254: 25.02,17.04 25.02,14.67 C13.1
$1N1211: length 3.1
  Top Layer w0.254: 22.48,17.04 22.48,14.92 C13.2
$1N1389: length 19.8
  Top Layer w0.254: U8.12 v1(27.56,20.83) ; v1(40.39,11.18) R8.1
  Bottom Layer w0.254: v1(27.56,20.83) 37.21,11.18 v1(40.39,11.18)
$1N1393: length 17.9
  Top Layer w0.254: v1(28.83,20.83) U8.11 ; R9.1 v1(40.39,13.72)
  Bottom Layer w0.254: v1(28.83,20.83) 28.83,20.19 35.31,13.72 v1(40.39,13.72)
$1N2440: length 2.4
  Top Layer w0.254: R2.2 16.34,18.11 Q1.1
$1N2442: length 6.3
  Top Layer w0.254: D1.2 14.22,21.25 Q1.3 14.14,22.44 13.67,22.9 LS1.2
$1N2545: length 2.1
  Top Layer w0.254: DS1.2 32.68,11.82 R3.1
$1N3356: length 24
  Top Layer w0.254: J1.4 15.92,30.73 R4.2 15.49,29.33 15.49,27.43 15.34,27.28 U2.2 14.43,27.3 13.38,27.3 C2.2
$1N3363: length 24
  Top Layer w0.254: J1.1 6.87,46.3 R5.2 7.37,29.32 7.37,27.82 6.82,27.28 U3.2 5.27,27.28 C4.1
$1N3670: length 23.7
  Top Layer w0.254: C9.2 36.27,27.28 U7.2 37.81,27.28 38.35,27.83 38.35,29.33 R7.2 38.5,30.45 J3.6

## Copper pours and planes (outline as drawn; the poured copper is in the pictures)
GND on Top Layer: -2.03,76.71 50.8,76.71 50.8,-11.94 -2.03,-11.94
GND on Bottom Layer: -26.16,66.04 62.23,66.04 62.23,-1.27 -26.16,-1.27

## Text on the board
Bottom Silkscreen Layer: UPDI
Top Silkscreen Layer: Key Switch | KO132C1501 | Version 2.0.1, June 24 | Access Control Core | Jim Heaney | RIT | SHED Makerspace | Button 19-B-M-F1 | 1 2 3 4 | VCC | DIN | DOUT | GND | COM | NO | NC
